# Altium project Quadrocopter.PrjPcb (part 2 of 2)

## Sheet PSU.SchDoc
size A3; SheetNumber: 12; SheetTotal: 12
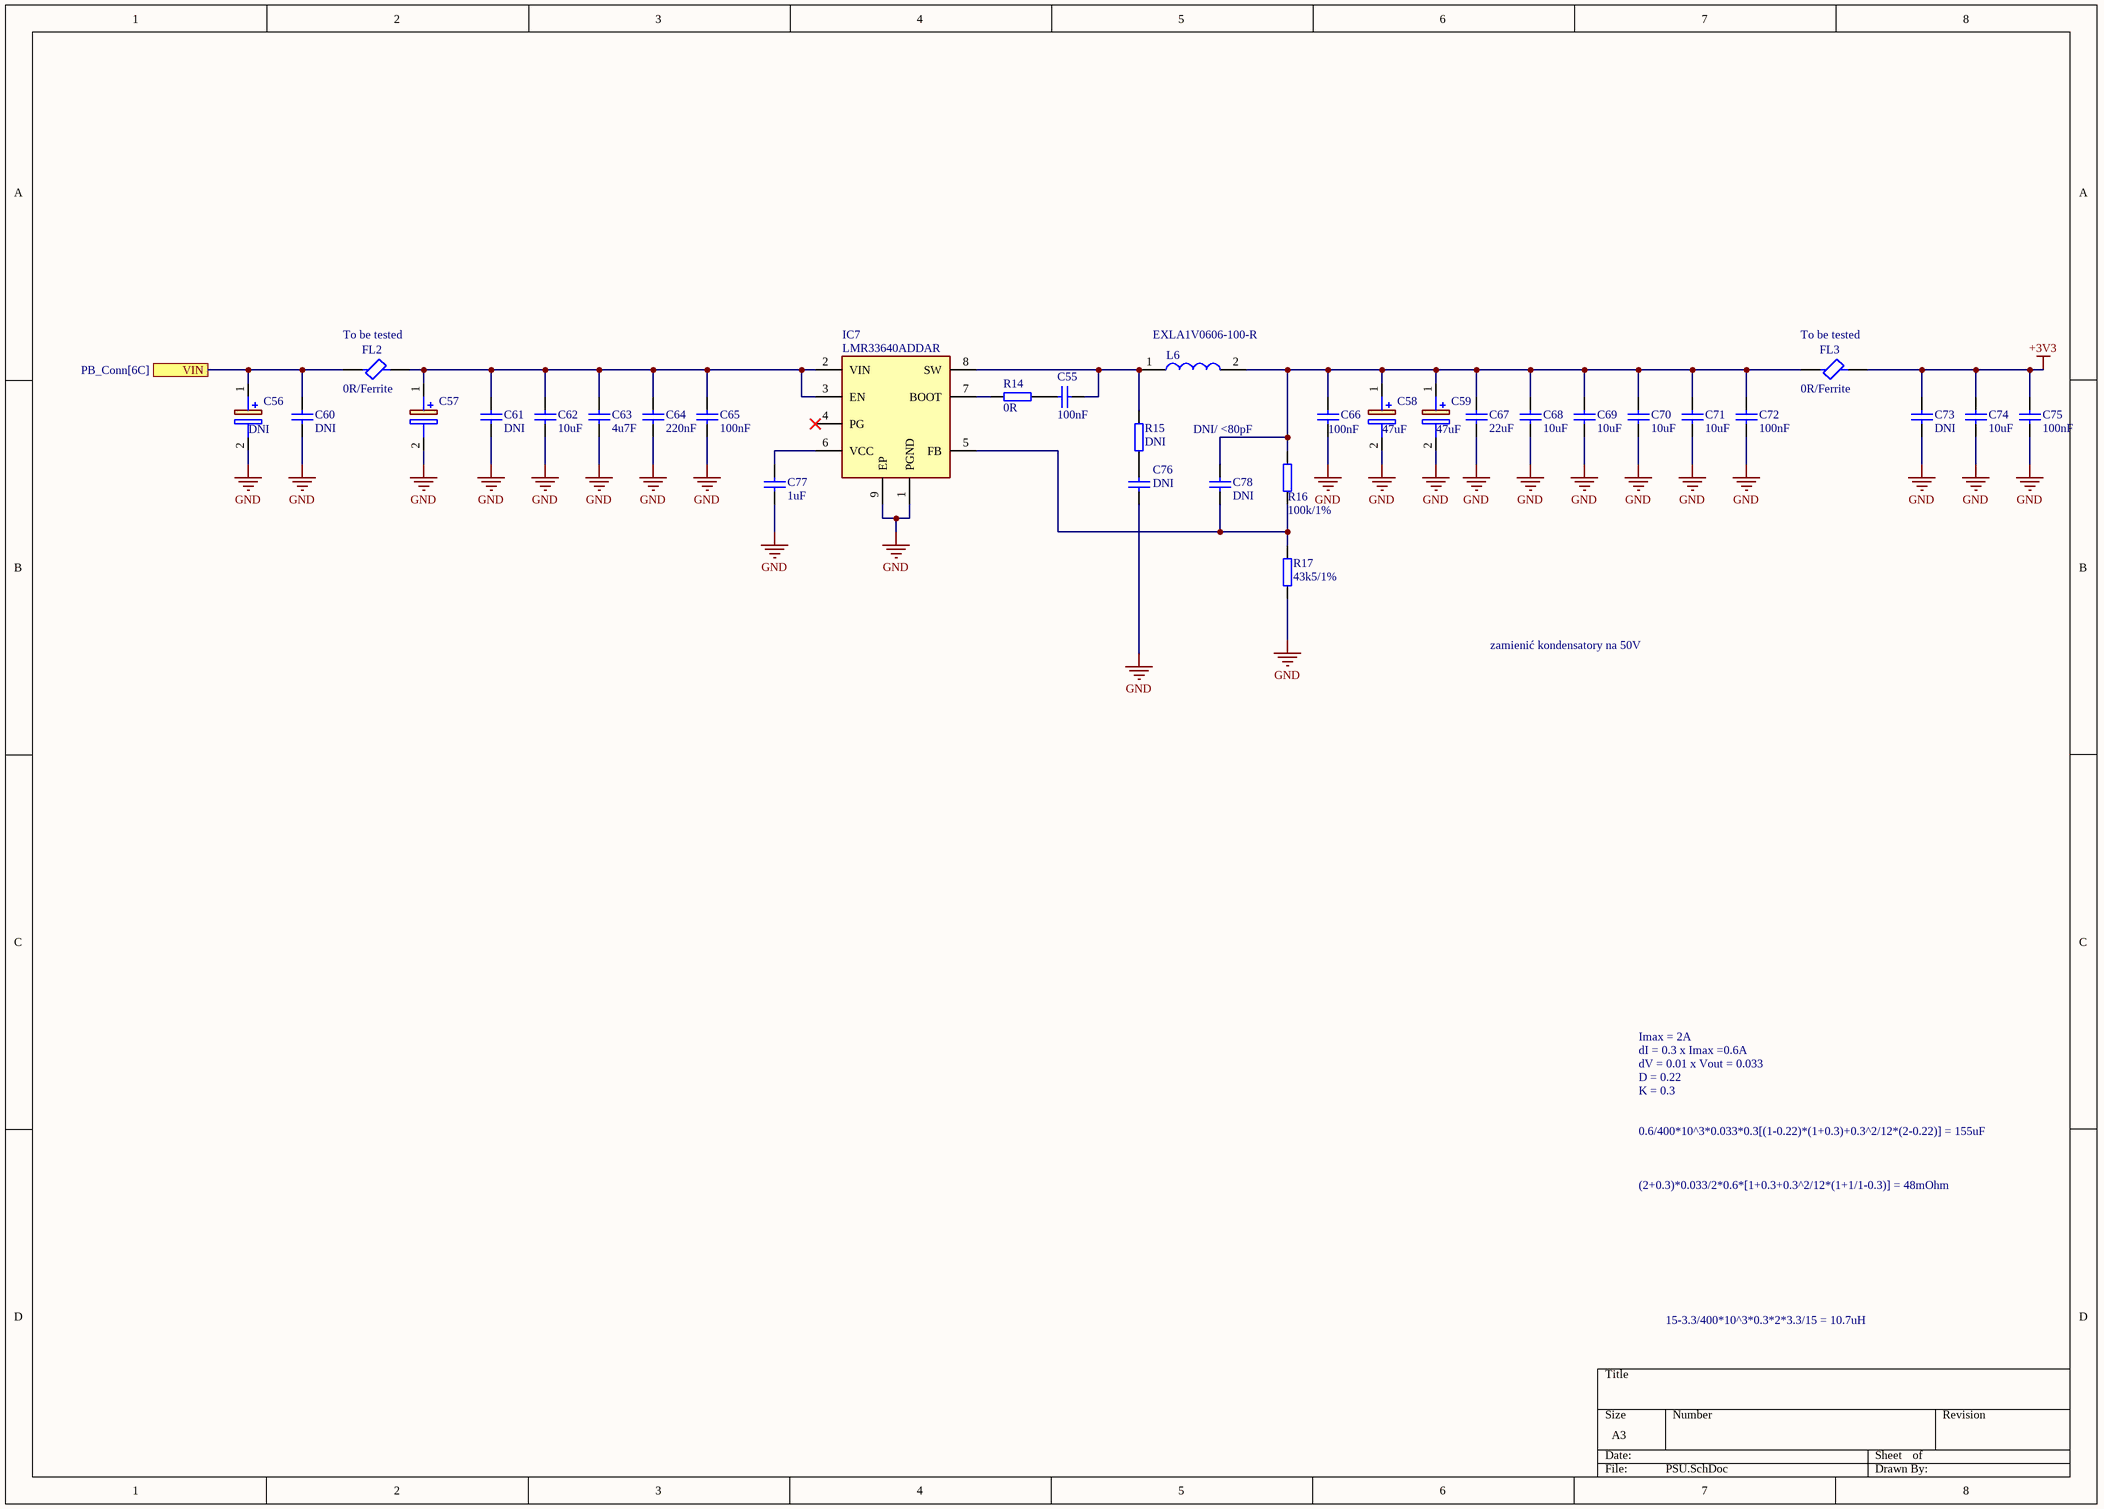
[diagram p9: PSU.SchDoc]

### Parts
(Parts that share a designator on the sheet are numbered #1, #2 ... from top to bottom, then left to right.)
C55  value 100nF  [CAP0402]  (hidden comment: Cap0402)
C56  value DNI  [CAPPM7343X310N]  (hidden comment: TR3D336K025D0200)
C57  TR3D336K025D0200  [CAPPM7343X310N]  (value not drawn)
C58  value 47uF  [CAPPC2012X90N]  (hidden comment: T58W9476M6R3C0200)
C59  value 47uF  [CAPPC2012X90N]  (hidden comment: T58W9476M6R3C0200)
C60  value DNI  [CAP0805]  (hidden comment: Cap0805)
C61  value DNI  [CAP0805]  (hidden comment: Cap0805)
C62  value 10uF  [CAP0805]  (hidden comment: Cap0805)
C63  value 4u7F  [CAP0805]  (hidden comment: Cap0805)
C64  value 220nF  [CAP0402]  (hidden comment: Cap0402)
C65  value 100nF  [CAP0402]  (hidden comment: Cap0402)
C66  value 100nF  [CAP0402]  (hidden comment: Cap0402)
C67  value 22uF  [CAP0805]  (hidden comment: Cap0805)
C68  value 10uF  [CAP0603]  (hidden comment: Cap0603)
C69  value 10uF  [CAP0603]  (hidden comment: Cap0603)
C70  value 10uF  [CAP0603]  (hidden comment: Cap0603)
C71  value 10uF  [CAP0603]  (hidden comment: Cap0603)
C72  value 100nF  [CAP0402]  (hidden comment: Cap0402)
C73  value DNI  [CAP0805]  (hidden comment: Cap0805)
C74  value 10uF  [CAP0603]  (hidden comment: Cap0603)
C75  value 100nF  [CAP0402]  (hidden comment: Cap0402)
C76  value DNI  [CAP0402]  (hidden comment: Cap0402)
C77  value 1uF  [CAP0402]  (hidden comment: Cap0402)
C78  value DNI  [CAP0402]  (hidden comment: Cap0402)
FL2  0R/Ferrite  [BLM31KN102BH1L]
FL3  0R/Ferrite  [BLM31KN102BH1L]
IC7  LMR33640ADDAR  [SOIC127P600X170-9N]
L6  EXLA1V0606-100-R  [EXLA1V0606100R]
R14#1  value 0R  [RES0402]  (hidden comment: Res0402)
R15#1  value DNI  [RES0402]  (hidden comment: Res0402)
R16#1  value 100k/1%  [RES0402]  (hidden comment: Res0402)
R17#1  value 43k5/1%  [RES0402]  (hidden comment: Res0402)

### Ports
VIN (see PB_Conn[6C])

### Nets
+3V3: C73.2 C74.2 C75.2 FL3.2
GND: C56.2(-) C57.2(-) C58.2(-) C59.2(-) C60.1 C61.1 C62.1 C63.1 C64.1 C65.1 C66.1 C67.1 C68.1 C69.1 C70.1 C71.1 C72.1 C73.1 C74.1 C75.1 C76.2 C77.1 IC7.1(PGND) IC7.9(EP) R17#1.1
NetC5#2_1: C56.1(+) C60.2 FL2.1 ; port VIN
NetC55_1: C55.1 R14#1.2
NetC55_2: C55.2 IC7.8(SW) L6.1 R15#1.1
NetC57_1: C57.1(+) C61.2 C62.2 C63.2 C64.2 C65.2 FL2.2 IC7.2(VIN) IC7.3(EN)
NetC58_1: C58.1(+) C59.1(+) C66.2 C67.2 C68.2 C69.2 C70.2 C71.2 C72.2 C78.2 FL3.1 L6.2 R16#1.2
NetC76_1: C76.1 R15#1.2
NetC77_2: C77.2 IC7.6(VCC)
NetC78_1: C78.1 IC7.5(FB) R16#1.1 R17#1.2
NetIC7_7: IC7.7(BOOT) R14#1.1

Not connected (* = marked no-connect by the designer): IC7 4(PG)*

### Notes on the sheet
- (near FL2) To be tested
- (near FL3) To be tested
- DNI/ <80pF
- zamienić kondensatory na 50V
- dI = 0.3 x Imax =0.6A
- Imax = 2A
- dV = 0.01 x Vout = 0.033
- K = 0.3
- D = 0.22
- 0.6/400*10^3*0.033*0.3[(1-0.22)*(1+0.3)+0.3^2/12*(2-0.22)] = 155uF
- (2+0.3)*0.033/2*0.6*[1+0.3+0.3^2/12*(1+1/1-0.3)] = 48mOhm
- 15-3.3/400*10^3*0.3*2*3.3/15 = 10.7uH

### Library data of the parts
C55 C66 C72 C75 = Cap0402: Voltage: 25V
C56 = TR3D336K025D0200: Capacitor Polarised; Voltage: DNI
C57 = TR3D336K025D0200: Capacitor Polarised; Manufacturer_Name: Vishay; Value: 33uF; Datasheet Link: http://www.vishay.com/doc?40080; Height: 3.1mm; Manufacturer_Part_Number: TR3D336K025D0200; Mouser Part Number: 74-TR3D336K025D0200; Mouser Price/Stock: https://www.mouser.com/Search/Refine.aspx?Keyword=74-TR3D336K025D0200
C58 C59 = T58W9476M6R3C0200: Capacitor Polarised; Voltage: 6V3
C60-C63 = Cap0805: Voltage: 35V
C64 C65 C77 = Cap0402: Voltage: 35V
C67 = Cap0805: Voltage: 25V
C68-C71 C74 = Cap0603: Voltage: 25V
FL2 FL3 = BLM31KN121SH1L: Filter
IC7 = LMR33640ADDAR: Integrated Circuit; Manufacturer_Name: Texas Instruments; Datasheet Link: https://www.ti.com/lit/gpn/LMR33640; Height: 1.7mm; Manufacturer_Part_Number: LMR33640ADDAR; Arrow Part Number: LMR33640ADDAR; Arrow Price/Stock: https://www.arrow.com/en/products/lmr33640addar/texas-instruments
L6 = EXLA1V0606-100-R: Inductor; Manufacturer_Name: Eaton; Datasheet Link: https://www.eaton.com/content/dam/eaton/products/electronic-components/resources/data-sheet/eaton-exla1v06-automotive-high-current-molded-inductor-data-sheet-elx1221-en.pdf; Height: 6mm; Manufacturer_Part_Number: EXLA1V0606-100-R; Mouser Part Number: 704-EXLA1V0606-100-R; Mouser Price/Stock: https://www.mouser.co.uk/ProductDetail/Bussmann-Eaton/EXLA1V0606-100-R?qs=T%252BzbugeAwjhRVU8Dylvhsg%3D%3D
C73 = Cap0805: Voltage: DNI
C76 C78 = Cap0402: Voltage: DNI

## Sheet BMS.SchDoc
size A2; SheetNumber: 3; SheetTotal: 10
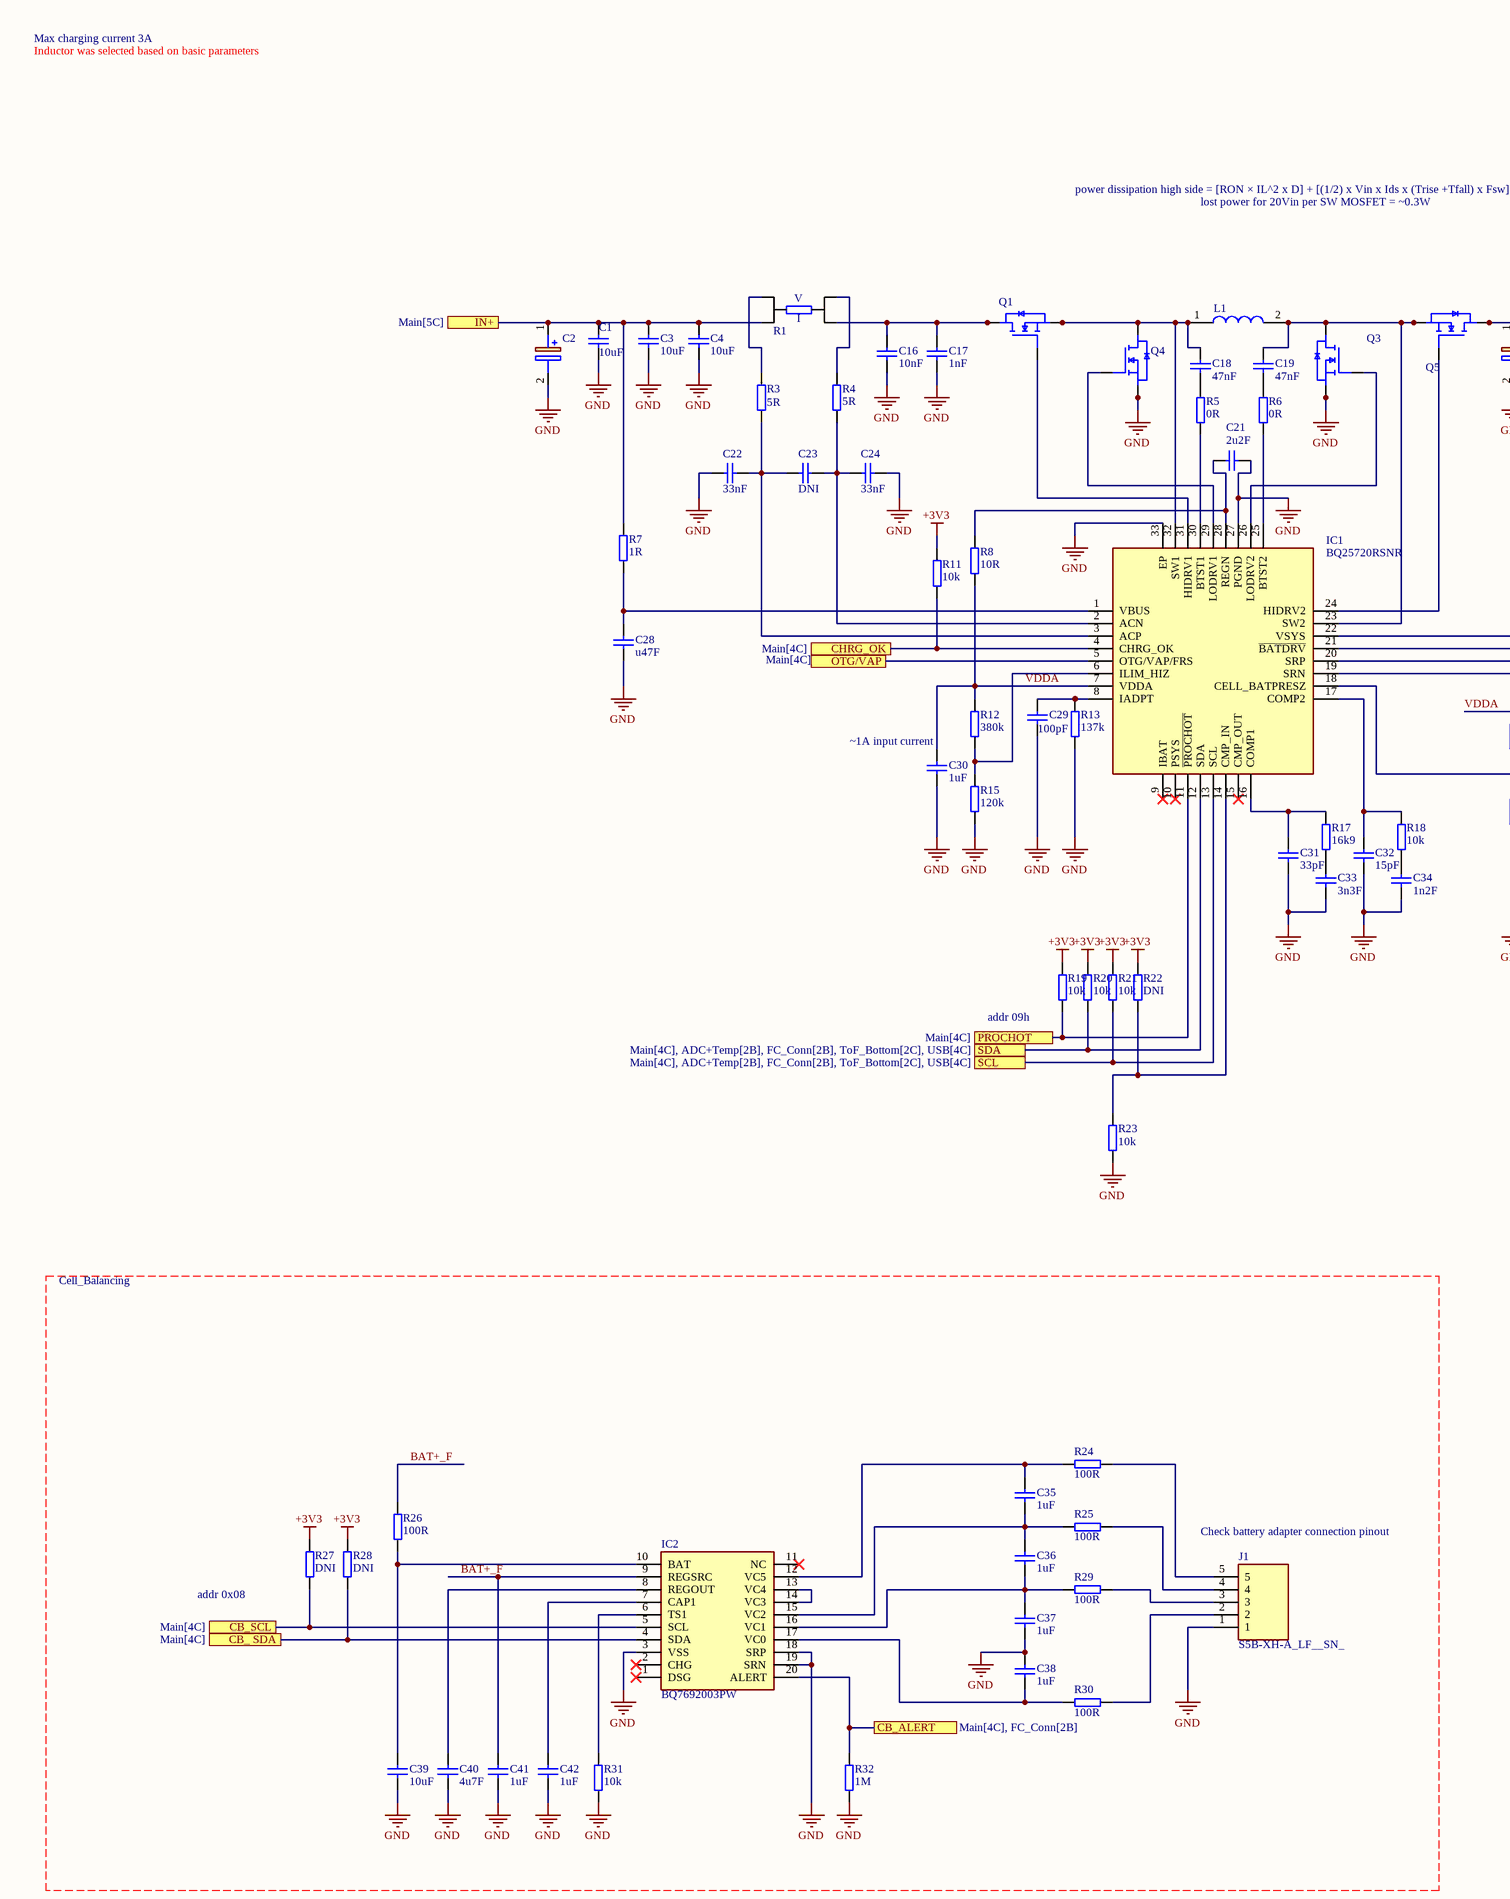
[diagram p10: BMS.SchDoc, left]
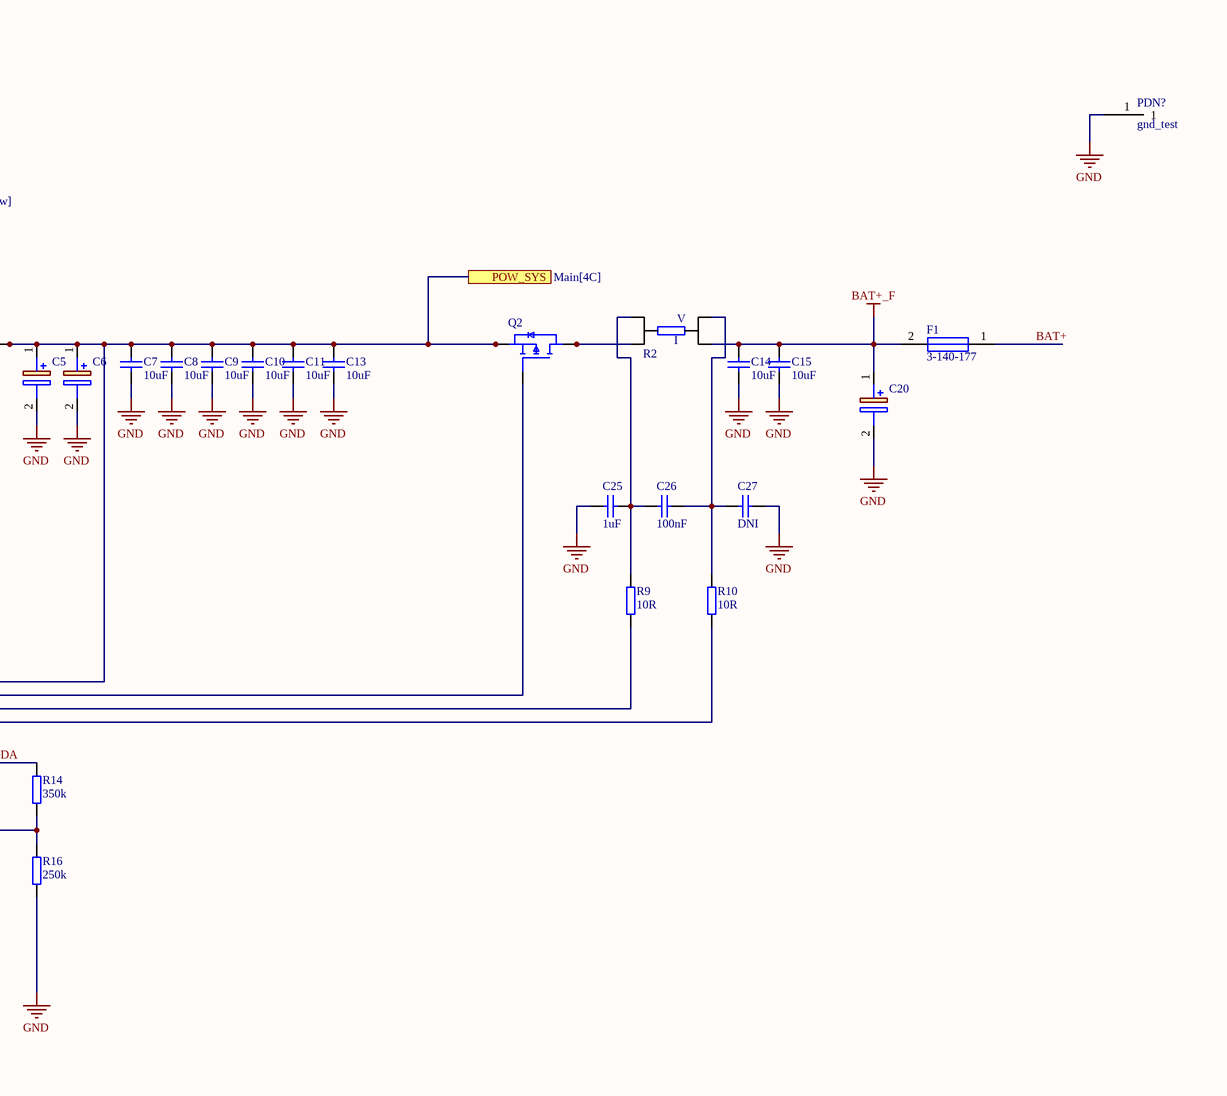
[diagram p11: BMS.SchDoc, right]

### Parts
(Parts that share a designator on the sheet are numbered #1, #2 ... from top to bottom, then left to right.)
C1#3  value 10uF  [CAP0603]  (hidden comment: Cap0603)
C2#3  TR3D336K025D0200  [CAPPM7343X310N]  (value not drawn)
C3#3  value 10uF  [CAP0805]  (hidden comment: Cap0805)
C4#3  value 10uF  [CAP0805]  (hidden comment: Cap0805)
C5#2  293D226X0025D2TE3  [CAPPM7343X310N]  (value not drawn)
C6#2  293D226X0025D2TE3  [CAPPM7343X310N]  (value not drawn)
C7#2  value 10uF  [CAP0805]  (hidden comment: Cap0805)
C8#2  value 10uF  [CAP0805]  (hidden comment: Cap0805)
C9#2  value 10uF  [CAP0805]  (hidden comment: Cap0805)
C10#2  value 10uF  [CAP0805]  (hidden comment: Cap0805)
C11#2  value 10uF  [CAP0805]  (hidden comment: Cap0805)
C13#2  value 10uF  [CAP0805]  (hidden comment: Cap0805)
C14#2  value 10uF  [CAP0805]  (hidden comment: Cap0805)
C15#2  value 10uF  [CAP0805]  (hidden comment: Cap0805)
C16#2  value 10nF  [CAP0402]  (hidden comment: Cap0402)
C17#2  value 1nF  [CAP0402]  (hidden comment: Cap0402)
C18#2  value 47nF  [CAP0402]  (hidden comment: Cap0402)
C19#2  value 47nF  [CAP0402]  (hidden comment: Cap0402)
C20#2  EEH-ZL1V151XP  [EEEHP1H4R7P]  (value not drawn)
C21#2  value 2u2F  [CAP0402]  (hidden comment: Cap0402)
C22#2  value 33nF  [CAP0402]  (hidden comment: Cap0402)
C23#2  value DNI  [CAP0402]  (hidden comment: Cap0402)
C24#2  value 33nF  [CAP0402]  (hidden comment: Cap0402)
C25#2  value 1uF  [CAP0402]  (hidden comment: Cap0402)
C26#2  value 100nF  [CAP0402]  (hidden comment: Cap0402)
C27#2  value DNI  [CAP0402]  (hidden comment: Cap0402)
C28#2  value u47F  [CAP0603]  (hidden comment: Cap0603)
C29#2  value 100pF  [CAP0402]  (hidden comment: Cap0402)
C30#2  value 1uF  [CAP0402]  (hidden comment: Cap0402)
C31#2  value 33pF  [CAP0402]  (hidden comment: Cap0402)
C32#2  value 15pF  [CAP0402]  (hidden comment: Cap0402)
C33#2  value 3n3F  [CAP0402]  (hidden comment: Cap0402)
C34#2  value 1n2F  [CAP0402]  (hidden comment: Cap0402)
C35#2  value 1uF  [CAP0402]  (hidden comment: Cap0402)
C36#2  value 1uF  [CAP0402]  (hidden comment: Cap0402)
C37#2  value 1uF  [CAP0402]  (hidden comment: Cap0402)
C38#2  value 1uF  [CAP0402]  (hidden comment: Cap0402)
C39#2  value 10uF  [CAP0805]  (hidden comment: Cap0805)
C40#2  value 4u7F  [CAP0805]  (hidden comment: Cap0402)
C41#2  value 1uF  [CAP0402]  (hidden comment: Cap0402)
C42#2  value 1uF  [CAP0402]  (hidden comment: Cap0402)
F1  3-140-177  [3140177]
IC1#3  BQ25720RSNR  [QFN40P400X400X80-33N-D]
IC2#2  BQ7692003PW  [SOP65P640X120-20N]
J1#2  S5B-XH-A_LF__SN_  [SHDRRA5W64P0X250_1X5_1490X1150X610P]
L1#2  XEL4020-222MEC  [XEL4020222MEC]  (value not drawn)
PDN?  gnd_test  [GND_test]
Q1#2  PMPB07R3ENAX  [DMT3006LFDF7]  (value not drawn)
Q2#2  SISA01DN-T1-GE3  [SIS862DNT1GE3]  (value not drawn)
Q3#2  PMPB07R3ENAX  [DMT3006LFDF7]  (value not drawn)
Q4#2  PMPB07R3ENAX  [DMT3006LFDF7]  (value not drawn)
Q5#2  PMPB07R3ENAX  [DMT3006LFDF7]  (value not drawn)
R1#3  L4CA0612LR010FNR  [L4CA0612L0M50FNR]  (value not drawn)
R2#3  L4CA0612LR010FNR  [L4CA0612L0M50FNR]  (value not drawn)
R3#3  value 5R  [RES0402]  (hidden comment: Res0402)
R4#3  value 5R  [RES0402]  (hidden comment: Res0402)
R5#3  value 0R  [RES0402]  (hidden comment: Res0402)
R6#3  value 0R  [RES0402]  (hidden comment: Res0402)
R7#3  value 1R  [RES0603]  (hidden comment: Res0603)
R8#3  value 10R  [RES0402]  (hidden comment: Res0402)
R9#3  value 10R  [RES0402]  (hidden comment: Res0402)
R10#3  value 10R  [RES0402]  (hidden comment: Res0402)
R11#3  value 10k  [RES0402]  (hidden comment: Res0402)
R12#3  value 380k  [RES0402]  (hidden comment: Res0402)
R13#2  value 137k  [RES0402]  (hidden comment: Res0402)
R14#2  value 350k  [RES0402]  (hidden comment: Res0402)
R15#2  value 120k  [RES0402]  (hidden comment: Res0402)
R16#2  value 250k  [RES0402]  (hidden comment: Res0402)
R17#2  value 16k9  [RES0402]  (hidden comment: Res0402)
R18  value 10k  [RES0402]  (hidden comment: Res0402)
R19  value 10k  [RES0402]  (hidden comment: Res0402)
R20  value 10k  [RES0402]  (hidden comment: Res0402)
R21  value 10k  [RES0402]  (hidden comment: Res0402)
R22  value DNI  [RES0402]  (hidden comment: Res0402)
R23  value 10k  [RES0402]  (hidden comment: Res0402)
R24  value 100R  [RES0805]  (hidden comment: Res0805)
R25  value 100R  [RES0805]  (hidden comment: Res0805)
R26  value 100R  [RES0402]  (hidden comment: Res0805)
R27  value DNI  [RES0402]  (hidden comment: Res0402)
R28  value DNI  [RES0402]  (hidden comment: Res0402)
R29  value 100R  [RES0805]  (hidden comment: Res0805)
R30  value 100R  [RES0805]  (hidden comment: Res0805)
R31  value 10k  [RES0402]  (hidden comment: Res0402)
R32  value 1M  [RES0402]  (hidden comment: Res0402)

### Ports
CB_ SDA (see Main[4C]), CB_ALERT (see Main[4C], FC_Conn[2B]), CB_SCL (see Main[4C]), CHRG_OK (see Main[4C]), IN+ (see Main[5C]), OTG/VAP (see Main[4C]), POW_SYS (see Main[4C]), PROCHOT (see Main[4C]), SCL (see Main[4C], ADC+Temp[2B], FC_Conn[2B], ToF_Bottom[2C], USB[4C]), SDA (see Main[4C], ADC+Temp[2B], FC_Conn[2B], ToF_Bottom[2C], USB[4C])

### Nets
+3V3: R11#3.2 R19.2 R20.2 R21.2 R22.2 R27.2 R28.2
BAT+_F: C14#2.2 C15#2.2 C20#2.1(+) C41#2.2 F1.2 IC2#2.9(REGSRC) R2#3.2 R26.2
GND: C1#3.1 C2#3.2(-) C3#3.1 C4#3.1 C5#2.2(-) C6#2.2(-) C7#2.1 C8#2.1 C9#2.1 C10#2.1 C11#2.1 C13#2.1 C14#2.1 C15#2.1 C16#2.1 C17#2.1 C20#2.2(-) C21#2.1 C22#2.1 C24#2.2 C25#2.1 C27#2.2 C28#2.1 C29#2.1 C30#2.1 C31#2.1 C32#2.1 C33#2.1 C34#2.1 C37#2.1 C38#2.2 C39#2.1 C40#2.1 C41#2.1 C42#2.1 IC1#3.27(PGND) IC1#3.33(EP) IC2#2.3(VSS) IC2#2.18(SRP) IC2#2.19(SRN) J1#2.1 PDN?.1 Q3#2.4(S_1) Q3#2.8(S_2) Q4#2.4(S_1) Q4#2.8(S_2) R13#2.1 R15#2.1 R16#2.1 R23.1 R31.1 R32.1
BAT+: F1.1
VDDA: C30#2.2 IC1#3.7(VDDA) R8#3.2 R12#3.2 R14#2.2
NetC1#3_2: C1#3.2 C2#3.1(+) C3#3.2 C4#3.2 R1#3.2 R7#3.2 ; port IN+
NetC5#2_1: C5#2.1(+) C6#2.1(+) C7#2.2 C8#2.2 C9#2.2 C10#2.2 C11#2.2 C13#2.2 IC1#3.22(VSYS) Q2#2.1(S_1) Q2#2.2(S_2) Q2#2.3(S_3) Q5#2.1(D_1) Q5#2.2(D_2) Q5#2.5(D_3) Q5#2.6(D_4) Q5#2.7(D_5) ; port POW_SYS
NetC16#2_2: C16#2.2 C17#2.2 Q1#2.1(D_1) Q1#2.2(D_2) Q1#2.5(D_3) Q1#2.6(D_4) Q1#2.7(D_5) R1#3.3
NetC18#2_1: C18#2.1 R5#3.2
NetC18#2_2: C18#2.2 IC1#3.32(SW1) L1#2.1 Q1#2.4(S_1) Q1#2.8(S_2) Q4#2.1(D_1) Q4#2.2(D_2) Q4#2.5(D_3) Q4#2.6(D_4) Q4#2.7(D_5)
NetC19#2_1: C19#2.1 R6#3.2
NetC19#2_2: C19#2.2 IC1#3.23(SW2) L1#2.2 Q3#2.1(D_1) Q3#2.2(D_2) Q3#2.5(D_3) Q3#2.6(D_4) Q3#2.7(D_5) Q5#2.4(S_1) Q5#2.8(S_2)
NetC21#2_2: C21#2.2 IC1#3.28(REGN) R8#3.1
NetC22#2_2: C22#2.2 C23#2.1 IC1#3.3(ACP) R3#3.1
NetC23#2_2: C23#2.2 C24#2.1 IC1#3.2(ACN) R4#3.1
NetC25#2_2: C25#2.2 C26#2.1 R2#3.4 R9#3.2
NetC26#2_2: C26#2.2 C27#2.1 R2#3.1 R10#3.2
NetC28#2_2: C28#2.2 IC1#3.1(VBUS) R7#3.1
NetC29#2_2: C29#2.2 IC1#3.8(IADPT) R13#2.2
NetC31#2_2: C31#2.2 IC1#3.16(COMP1) R17#2.2
NetC32#2_2: C32#2.2 IC1#3.17(COMP2) R18.2
NetC33#2_2: C33#2.2 R17#2.1
NetC34#2_2: C34#2.2 R18.1
NetC35#2_1: C35#2.1 C36#2.2 IC2#2.15(VC2) R25.1
NetC35#2_2: C35#2.2 IC2#2.12(VC5) R24.1
NetC36#2_1: C36#2.1 C37#2.2 IC2#2.16(VC1) R29.1
NetC38#2_1: C38#2.1 IC2#2.17(VC0) R30.1
NetC39#2_2: C39#2.2 IC2#2.10(BAT) R26.1
NetC40#2_2: C40#2.2 IC2#2.8(REGOUT)
NetC42#2_2: C42#2.2 IC2#2.7(CAP1)
NetIC1#3_4: IC1#3.4(CHRG_OK) R11#3.1 ; port CHRG_OK
NetIC1#3_5: IC1#3.5(OTG/VAP/FRS) ; port OTG/VAP
NetIC1#3_6: IC1#3.6(ILIM_HIZ) R12#3.1 R15#2.2
NetIC1#3_11: IC1#3.11(~{PROCHOT}) R19.1 ; port PROCHOT
NetIC1#3_12: IC1#3.12(SDA) R20.1 ; port SDA
NetIC1#3_13: IC1#3.13(SCL) R21.1 ; port SCL
NetIC1#3_14: IC1#3.14(CMP_IN) R22.1 R23.2
NetIC1#3_18: IC1#3.18(CELL_BATPRESZ) R14#2.1 R16#2.2
NetIC1#3_19: IC1#3.19(SRN) R10#3.1
NetIC1#3_20: IC1#3.20(SRP) R9#3.1
NetIC1#3_21: IC1#3.21(~{BATDRV}) Q2#2.4(G)
NetIC1#3_24: IC1#3.24(HIDRV2) Q5#2.3(G)
NetIC1#3_25: IC1#3.25(BTST2) R6#3.1
NetIC1#3_26: IC1#3.26(LODRV2) Q3#2.3(G)
NetIC1#3_29: IC1#3.29(LODRV1) Q4#2.3(G)
NetIC1#3_30: IC1#3.30(BTST1) R5#3.1
NetIC1#3_31: IC1#3.31(HIDRV1) Q1#2.3(G)
NetIC2#2_4: IC2#2.4(SDA) R28.1 ; port CB_ SDA
NetIC2#2_5: IC2#2.5(SCL) R27.1 ; port CB_SCL
NetIC2#2_6: IC2#2.6(TS1) R31.2
NetIC2#2_13: IC2#2.13(VC4) IC2#2.14(VC3)
NetIC2#2_20: IC2#2.20(ALERT) R32.2 ; port CB_ALERT
NetJ1#2_2: J1#2.2 R30.2
NetJ1#2_3: J1#2.3 R29.2
NetJ1#2_4: J1#2.4 R25.2
NetJ1#2_5: J1#2.5 R24.2
NetQ2#2_5: Q2#2.5(D_1) Q2#2.6(D_2) Q2#2.7(D_3) Q2#2.8(D_4) Q2#2.9(D_4) R2#3.3
NetR1#3_1: R1#3.1 R3#3.2
NetR1#3_4: R1#3.4 R4#3.2

Not connected (* = marked no-connect by the designer): IC1#3 9(IBAT)* 10(PSYS)* 15(CMP_OUT)*; IC2#2 1(DSG)* 2(CHG)* 11(NC)*

### Notes on the sheet
- Max charging current 3A
- Inductor was selected based on basic parameters
- power dissipation high side = [RON × IL^2 x D] + [(1/2) x Vin x Ids x (Trise +Tfall) x Fsw]
- lost power for 20Vin per SW MOSFET = ~0.3W
- (near C30#2) ~1A input current
- (near R19) addr 09h
- Cell_Balancing
- (near J1#2) Check battery adapter connection pinout
- addr 0x08
- (in symbol L4CA0612LR010FNR) V; I

### Library data of the parts
C1#3 C28#2 = Cap0603: Voltage: 25V
C2#3 = TR3D336K025D0200: Capacitor Polarised; Manufacturer_Name: Vishay; Value: 33uF; Datasheet Link: http://www.vishay.com/doc?40080; Height: 3.1mm; Manufacturer_Part_Number: TR3D336K025D0200; Mouser Part Number: 74-TR3D336K025D0200; Mouser Price/Stock: https://www.mouser.com/Search/Refine.aspx?Keyword=74-TR3D336K025D0200
C3#3 C4#3 C7#2 C8#2 C9#2 C10#2 C11#2 C13#2 C14#2 C15#2 C39#2 = Cap0805: Voltage: 50V
C5#2 C6#2 = 293D226X0025D2TE3: Capacitor Polarised; Manufacturer_Name: Vishay; Value: 22uF; Datasheet Link: http://www.vishay.com/docs/40002/293d.pdf; Height: 3.1mm; Manufacturer_Part_Number: 293D226X0025D2TE3; Mouser Part Number: 74-293D226X0025D2TE3; Mouser Price/Stock: https://www.mouser.co.uk/ProductDetail/Vishay-Sprague/293D226X0025D2TE3?qs=27QRfRkF2isTHSjSebANCw%3D%3D
C16#2 C17#2 C18#2 C19#2 C40#2 C41#2 C42#2 = Cap0402: Voltage: 50V
C20#2 = EEH-ZL1V151XP: Capacitor Polarised; Manufacturer_Name: Panasonic; Datasheet Link: https://industrial.panasonic.com/cdbs/www-data/pdf/RDD0000/ast-ind-303928.pdf; Manufacturer_Part_Number: EEH-ZL1V151XP
C21#2 C29#2 C30#2 C31#2 C32#2 C33#2 C34#2 = Cap0402: Voltage: 25V
C22#2 C24#2 C25#2 C26#2 C35#2 C36#2 C37#2 C38#2 = Cap0402: Voltage: 6V3
F1 = 3-140-177: Fuse; Manufacturer_Name: SCHURTER; Datasheet Link: https://www.schurter.com/en/datasheet/typ_UHS.pdf; Height: 4.85mm; Manufacturer_Part_Number: 3-140-177; Mouser Part Number: 693-3-140-177; Mouser Price/Stock: https://www.mouser.co.uk/ProductDetail/Schurter/3-140-177?qs=3Rah4i%252BhyCHL3c0yS6dOkg%3D%3D; Arrow Part Number: 3-140-177; Arrow Price/Stock: https://www.arrow.com/en/products/3-140-177/schurter?region=europe
IC1#3 = BQ25720RSNR: Integrated Circuit; Manufacturer_Name: Texas Instruments; Datasheet Link: https://www.ti.com/lit/ds/symlink/bq25720.pdf?ts=1649085131820&ref_url=https%253A%252F%252Fwww.ti.com%252Fproduct%252FBQ25720; Height: 0.8mm; Manufacturer_Part_Number: BQ25720RSNR; Mouser Part Number: 595-BQ25720RSNR; Mouser Price/Stock: https://www.mouser.co.uk/ProductDetail/Texas-Instruments/BQ25720RSNR?qs=ljCeji4nMDlwF8f%2Foae7aQ%3D%3D
IC2#2 = BQ7692003PW: Integrated Circuit; Manufacturer_Name: Texas Instruments; Datasheet Link: http://www.ti.com/lit/gpn/BQ76920; Height: 1.2mm; Manufacturer_Part_Number: BQ7692003PW; Mouser Part Number: 595-BQ7692003PW; Mouser Price/Stock: https://www.mouser.co.uk/ProductDetail/Texas-Instruments/BQ7692003PW?qs=%2Fd%252BFzHvH4c0Hx6X3GvdboA%3D%3D; Arrow Part Number: BQ7692003PW; Arrow Price/Stock: https://www.arrow.com/en/products/bq7692003pw/texas-instruments?utm_currency=USD&region=nac
J1#2 = S5B-XH-A_LF__SN_: Connector; Manufacturer_Name: JST (JAPAN SOLDERLESS TERMINALS); Manufacturer_Part_Number: S5B-XH-A(LF)(SN); Datasheet Link: http://www.jst-mfg.com/product/pdf/eng/eXH.pdf; Height: 6.1mm; Mouser Part Number: 306-S5B-XH-ALFSN; Mouser Price/Stock: https://www.mouser.co.uk/ProductDetail/JST-Commercial/S5B-XH-ALFSN?qs=QpmGXVUTftFJm7Okp%252B2lFg%3D%3D; Arrow Part Number: S5B-XH-A(LF)(SN); Arrow Price/Stock: https://www.arrow.com/en/products/s5b-xh-a-lf-sn/jst-manufacturing?utm_currency=USD&region=europe
L1#2 = XEL4020-222MEC: Inductor; Manufacturer_Name: COILCRAFT; Height: 2.1mm; Manufacturer_Part_Number: XEL4020-222MEC; Mouser Part Number: 994-XEL4020-222MEC; Mouser Price/Stock: https://www.mouser.co.uk/ProductDetail/Coilcraft/XEL4020-222MEC?qs=chTDxNqvsynf4rqMeCpizg%3D%3D
Q1#2 Q3#2 Q4#2 Q5#2 = DMT3006LFDF-7: MOSFET (N-Channel); Manufacturer_Name: Diodes Incorporated; Datasheet Link: https://www.arrow.com/en/products/dmt3006lfdf-7/diodes-incorporated; Height: 0.63mm; Manufacturer_Part_Number: DMT3006LFDF-7; Mouser Part Number: 621-DMT3006LFDF-7; Mouser Price/Stock: https://www.mouser.co.uk/ProductDetail/Diodes-Incorporated/DMT3006LFDF-7?qs=4EhzHfbM1GhGS5nn3gf3wg%3D%3D; Arrow Part Number: DMT3006LFDF-7; Arrow Price/Stock: https://www.arrow.com/en/products/dmt3006lfdf-7/diodes-incorporated
Q2#2 = SISA01DN-T1-GE3: MOSFET (P-Channel); Manufacturer_Name: Vishay; Datasheet Link: https://www.vishay.com/docs/76198/sisa01dn.pdf; Manufacturer_Part_Number: SISA01DN-T1-GE3; Mouser Part Number: 78-SISA01DN-T1-GE3; Mouser Price/Stock: https://www.mouser.co.uk/ProductDetail/Vishay-Semiconductors/SISA01DN-T1-GE3?qs=chTDxNqvsymq6IcOj9ze4g%3D%3D; Arrow Part Number: SISA01DN-T1-GE3; Arrow Price/Stock: https://www.arrow.com/en/products/sisa01dn-t1-ge3/vishay?region=nac
R1#3 R2#3 = L4CA0612LR010FNR: Resistor; Manufacturer_Name: LITTELFUSE; Datasheet Link: https://www.littelfuse.com/media?resourcetype=datasheets&itemid=db674d7b-aa25-4173-816a-92297475a59f&filename=littelfuse-resistor-l4ca-c-datasheet; Height: 0.7mm; Manufacturer_Part_Number: L4CA0612LR010FNR
C23#2 C27#2 = Cap0402: Voltage: DNI

## Sheet ToF.SchDoc
size A3; SheetNumber: 1; SheetTotal: 1
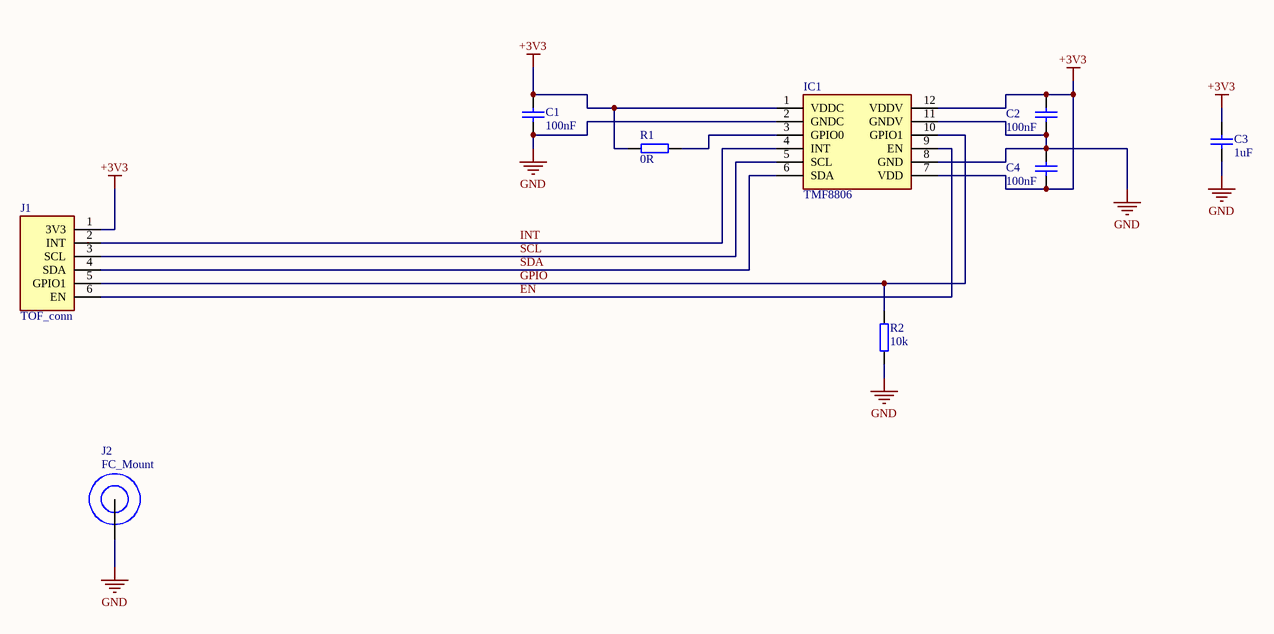
[diagram p12: ToF.SchDoc]

### Parts
(Parts that share a designator on the sheet are numbered #1, #2 ... from top to bottom, then left to right.)
C1#4  value 100nF  [CAP0402]  (hidden comment: Cap0402)
C2#4  value 100nF  [CAP0402]  (hidden comment: Cap0402)
C3#4  value 1uF  [CAP0603]  (hidden comment: Cap0603)
C4#4  value 100nF  [CAP0402]  (hidden comment: Cap0402)
IC1#4  TMF8806  [TMF88051B]
J1#3  TOF_conn  [PCBComponent_1]
J2#3  FC_Mount  [FC_Mount]
R1#4  value 0R  [RES0402]  (hidden comment: Res0402)
R2#4  value 10k  [RES0402]  (hidden comment: Res0402)

### Nets
+3V3: C1#4.2 C2#4.2 C3#4.2 C4#4.1 IC1#4.1(VDDC) IC1#4.7(VDD) IC1#4.12(VDDV) J1#3.1(3V3) R1#4.1
GND: C1#4.1 C2#4.1 C3#4.1 C4#4.2 IC1#4.2(GNDC) IC1#4.8(GND) IC1#4.11(GNDV) J2#3.1 R2#4.1
EN: IC1#4.9(EN) J1#3.6(EN)
GPIO: IC1#4.10(GPIO1) J1#3.5(GPIO1) R2#4.2
INT: IC1#4.4(INT) J1#3.2(INT)
SCL: IC1#4.5(SCL) J1#3.3(SCL)
SDA: IC1#4.6(SDA) J1#3.4(SDA)
NetIC1#4_3: IC1#4.3(GPIO0) R1#4.2

### Library data of the parts
C1#4 C2#4 C4#4 = Cap0402: Voltage: 6V3
C3#4 = Cap0603: Voltage: 25V
IC1#4 = TMF8805-1B: Integrated Circuit; Manufacturer_Name: ams OSRAM; Datasheet Link: https://ams.com/documents/20143/4372629/TMF8805_DS000692_4-00.pdf; Height: 1.1mm; Manufacturer_Part_Number: TMF8805-1B; Mouser Part Number: 985-TMF8805-1B; Mouser Price/Stock: https://www.mouser.co.uk/ProductDetail/ams-OSRAM/TMF8805-1B?qs=sPbYRqrBIVlwsjHE%2F%252BrL9g%3D%3D

## Nets that join several sheets
+3V3: MCU (31 pins), IMU (19 pins), RF (U1.1), NRF24l01 (10 pins), ESC (11 pins), USB (9 pins), PSU (C73.2 C74.2 C75.2 FL3.2), BMS (7 pins), ToF (9 pins)
BAT+_F: ESC (12 pins), BMS (8 pins)
GND: MCU (45 pins), IMU (35 pins), RF (U1.2), NRF24l01 (40 pins), ESC (9 pins), USB (26 pins), PSU (25 pins), BMS (52 pins), ToF (9 pins)
NetC5#2_1: PSU (C56.1 C60.2 FL2.1), BMS (17 pins)
NetIC1#1_5: MCU (IC4#1.125), IMU (IC1#1.5 R1#1.1)
NetIC1#1_6: MCU (IC4#1.118), IMU (IC1#1.6)
NetIC1#1_8: MCU (IC4#1.119), IMU (IC1#1.8 IC2#1.9 IC3#1.7)
NetIC2#1_4: MCU (IC4#1.2), IMU (IC2#1.4)
NetIC2#1_12: MCU (IC4#1.132), IMU (IC2#1.12)
NetIC3#1_1: MCU (IC4#1.22), IMU (IC3#1.1)
NetIC3#1_2: MCU (IC4#1.18), IMU (IC3#1.2)
NetIC4#1_110: MCU (IC4#1.110), RF (U1.3), NRF24l01 (IC6.1)
NetIC4#1_111: MCU (IC4#1.111), RF (U1.5), NRF24l01 (IC6.3)
NetIC4#1_112: MCU (IC4#1.112), RF (U1.7), NRF24l01 (IC6.5)
NetIC4#1_113: MCU (IC4#1.113), RF (U1.6), NRF24l01 (IC6.4)
NetIC4#1_114: MCU (IC4#1.114), RF (U1.4), NRF24l01 (IC6.2)
NetIC4#1_115: MCU (IC4#1.115), RF (U1.8), NRF24l01 (IC6.6)
NetIC4#1_116: MCU (IC4#1.116), NRF24l01 (R11#1.1)
NetIC4#1_117: MCU (IC4#1.117), NRF24l01 (R12#1.1)
SPI1_MISO: MCU (IC4#1.124), IMU (IC1#1.4)
SPI1_MOSI: MCU (IC4#1.123), IMU (IC1#1.3)
SPI1_SCK: MCU (IC4#1.126), IMU (IC1#1.2)
SPI5_MISO: MCU (IC4#1.20), IMU (IC3#1.6)
SPI5_MOSI: MCU (IC4#1.21), IMU (IC3#1.5)
SPI5_SCK: MCU (IC4#1.19), IMU (IC3#1.3)
SPI6_MISO: MCU (IC4#1.127), IMU (IC2#1.1)
SPI6_MOSI: MCU (IC4#1.129), IMU (IC2#1.14)
SPI6_SCK: MCU (IC4#1.128), IMU (IC2#1.13)